# EAGLE design BSAT - Battery Shield (EAGLE 6.5.0)
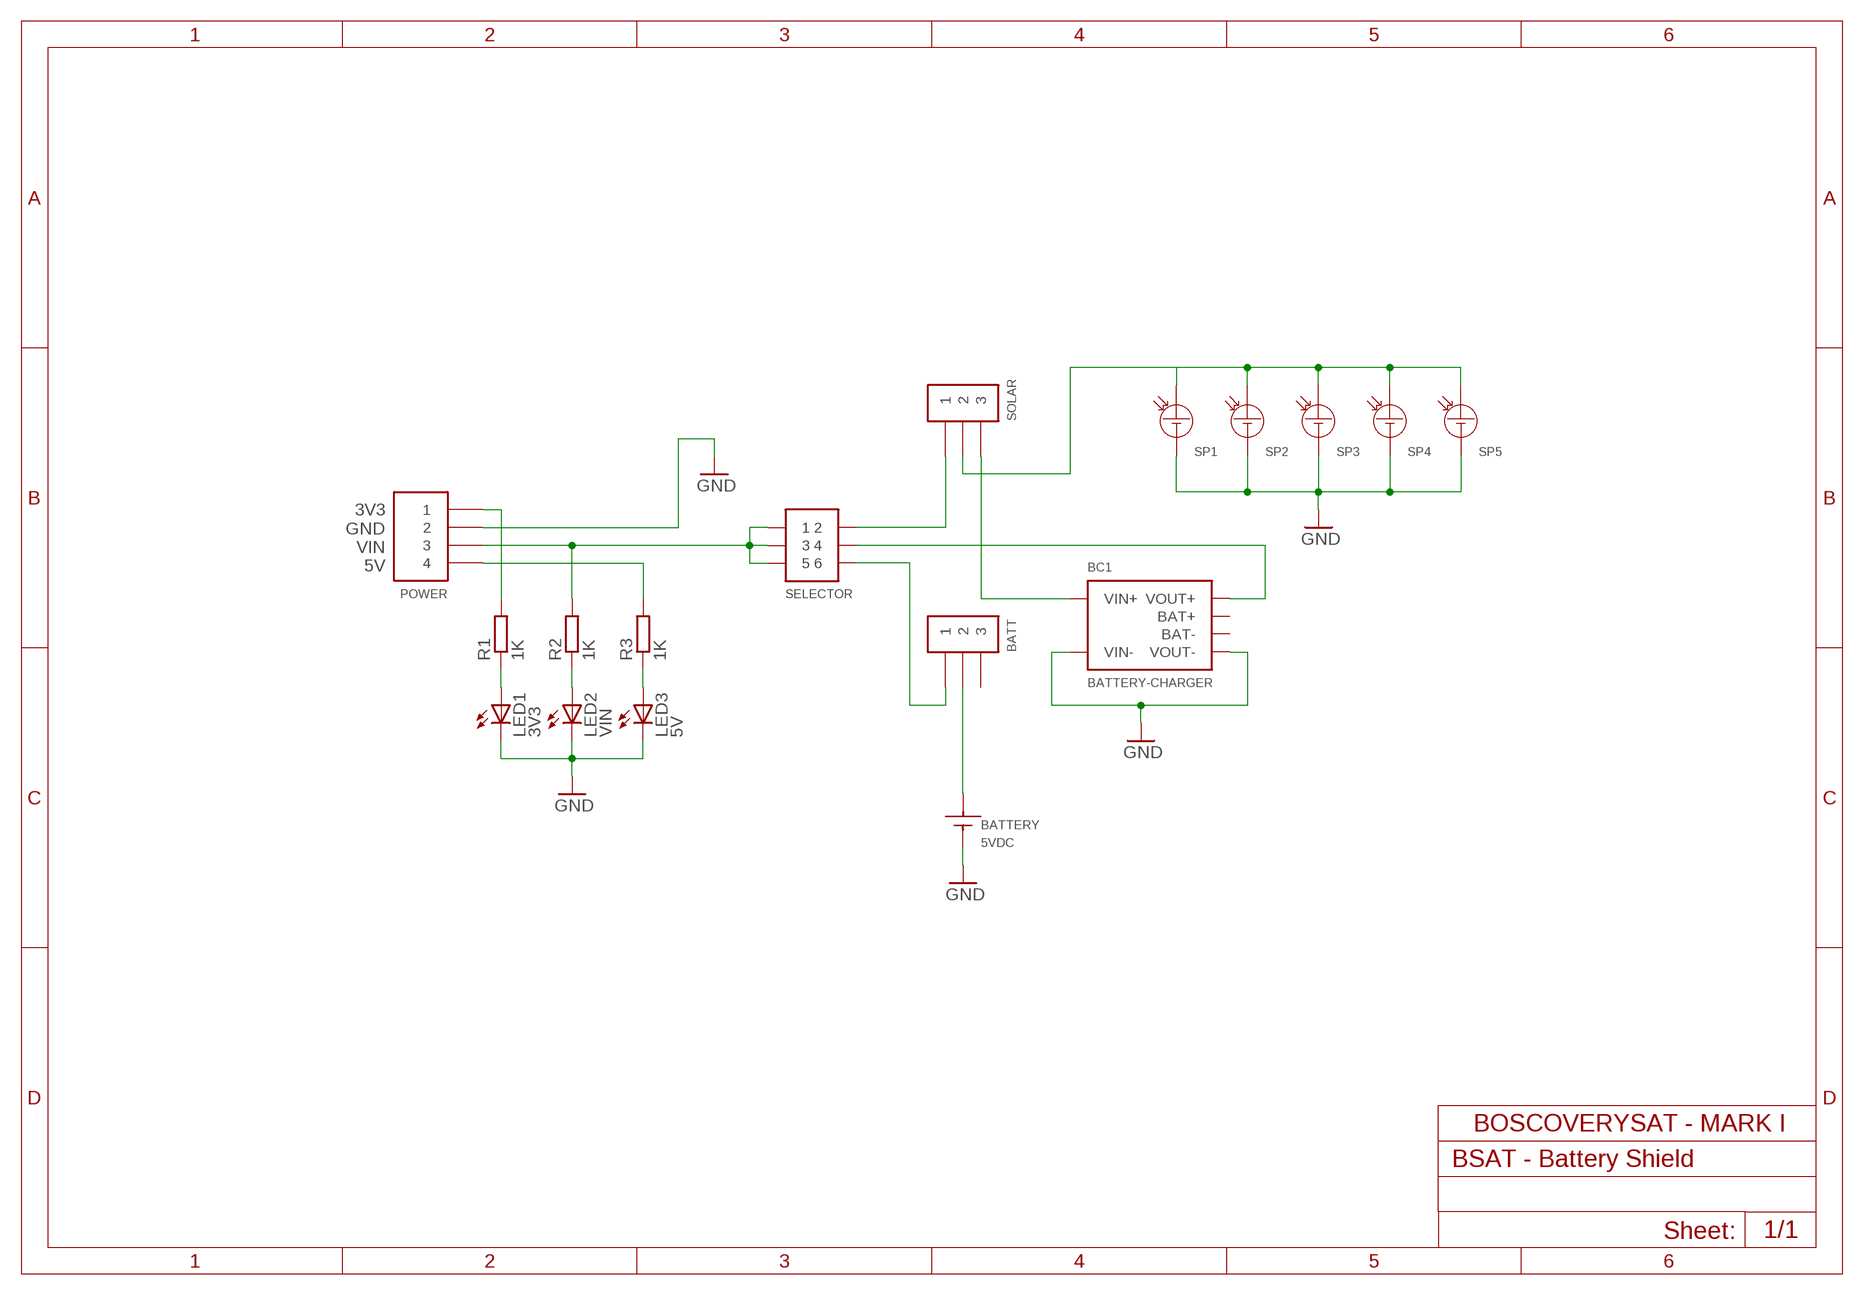
[diagram p0: schematic, sheet 1]

## Parts
5VDC  BATTERY  [SOLAR-PANEL]
BATT  3-PIN-JUMPER  [3-PIN-JUMPER]
BC1  BATTERY-CHARGER  [BATTERY-CHARGER]
LED1  3V3  LED3MM  [LED3MM]
LED2  VIN  LED3MM  [LED3MM]
LED3  5V  LED3MM  [LED3MM]
POWER  4-PIN-DUAL-BUS  [4-PIN-LINEAL-JUMPER]
R1  1K  R-EU_0207/12  [0207/12]
R2  1K  R-EU_0207/12  [0207/12]
R3  1K  R-EU_0207/12  [0207/12]
SELECTOR  3-PIN-PARALEL-JUMPER  [3-PIN-PARALEL-JUMPER]
SOLAR  3-PIN-JUMPER  [3-PIN-JUMPER]
SP1  SOLAR-PANEL2  [SOLAR-PANEL]
SP2  SOLAR-PANEL2  [SOLAR-PANEL]
SP3  SOLAR-PANEL2  [SOLAR-PANEL]
SP4  SOLAR-PANEL2  [SOLAR-PANEL]
SP5  SOLAR-PANEL2  [SOLAR-PANEL]

## Nets
GND: 5VDC.NEG BC1.VIN- BC1.VOUT- LED1.K(C) LED2.K(C) LED3.K(C) POWER.2A POWER.2B SP1.NEG SP2.NEG SP3.NEG SP4.NEG SP5.NEG
N$1: SELECTOR.2 SOLAR.1
N$2: SOLAR.2 SP1.POS SP2.POS SP3.POS SP4.POS SP5.POS
N$3: BC1.VIN+ SOLAR.3
N$4: BC1.VOUT+ SELECTOR.4
N$5: BATT.1 SELECTOR.6
N$6: 5VDC.POS BATT.2
N$8: LED1.A R1.1
N$9: POWER.3A POWER.3B R2.2 SELECTOR.1 SELECTOR.3 SELECTOR.5
N$10: LED2.A R2.1
N$11: LED3.A R3.1
N$12: POWER.1A POWER.1B R1.2
N$13: POWER.4A POWER.4B R3.2
Unconnected: BATT.3 BC1.BAT+ BC1.BAT-

## Notes on the sheet
- 3V3
  GND
  VIN
  5V

## Library data of the parts
5VDC = boscoverysat:BATTERY
BATT SOLAR = boscoverysat:3-PIN-JUMPER
BC1 = boscoverysat:BATTERY-CHARGER
LED1-LED3 = boscoverysat:LED: LED OSRAM: - CHIPLED LG R971, LG N971, LY N971, LG Q971, LY Q971, LO R971, LY R971 LH N974, LH R974 LS Q976, LO Q976, LY Q976 LO Q996 - Hyper CHIPLED LW Q18S LB Q993, LB Q99A, LB R99A - SideLED LS A670, LO A670, LY A670, LG A670, LP A670 LB A673, LV A673, LT A673, LW A673 LH A674 LY A675 LS A676, LA A676, LO A676, LY A676, LW A676 LS A679, LY A679, LG A679 - Hyper Micro SIDELED® LS Y876, LA Y876, LO Y876, LY Y876 LT Y87S - SmartLED LW L88C, LW L88S LB L89C, LB L89S, LG L890 LS L89K, LO L89K, LY L89K LS L896, LA L896, LO L896, LY L896 - TOPLED LS T670, LO T670, LY T670, LG T670, LP T670 LSG T670, LSP T670, LSY T670, LOP T670, LYG T670 LG T671, LOG T671, LSG T671 LB T673, LV T673, LT T673, LW T673 LH T674 LS T676, LA T676, LO T676, LY T676, LB T676, LH T676, LSB T676, LW T676 LB T67C, LV T67C, LT T67C, LS T67K, LO T67K, LY T67K, LW E67C LS E67B, LA E67B, LO E67B, LY E67B, LB E67C, LV E67C, LT E67C LW T67C LS T679, LY T679, LG T679 LS T770, LO T770, LY T770, LG T770, LP T770 LB T773, LV T773, LT T773, LW T773 LH T774 LS E675, LA E675, LY E675, LS T675 LS T776, LA T776, LO T776, LY T776, LB T776 LHGB T686 LT T68C, LB T68C - Hyper Mini TOPLED® LB M676 - Mini TOPLED Santana® LG M470 LS M47K, LO M47K, LY M47K Source: http://www.osram.convergy.de/
POWER = boscoverysat:4-PIN-DUAL-BUS
R1-R3 = boscoverysat:R-EU_: RESISTOR, European symbol
SELECTOR = boscoverysat:3-PIN-PARALEL-JUMPER
SP1-SP5 = boscoverysat:SOLAR-PANEL

## Board
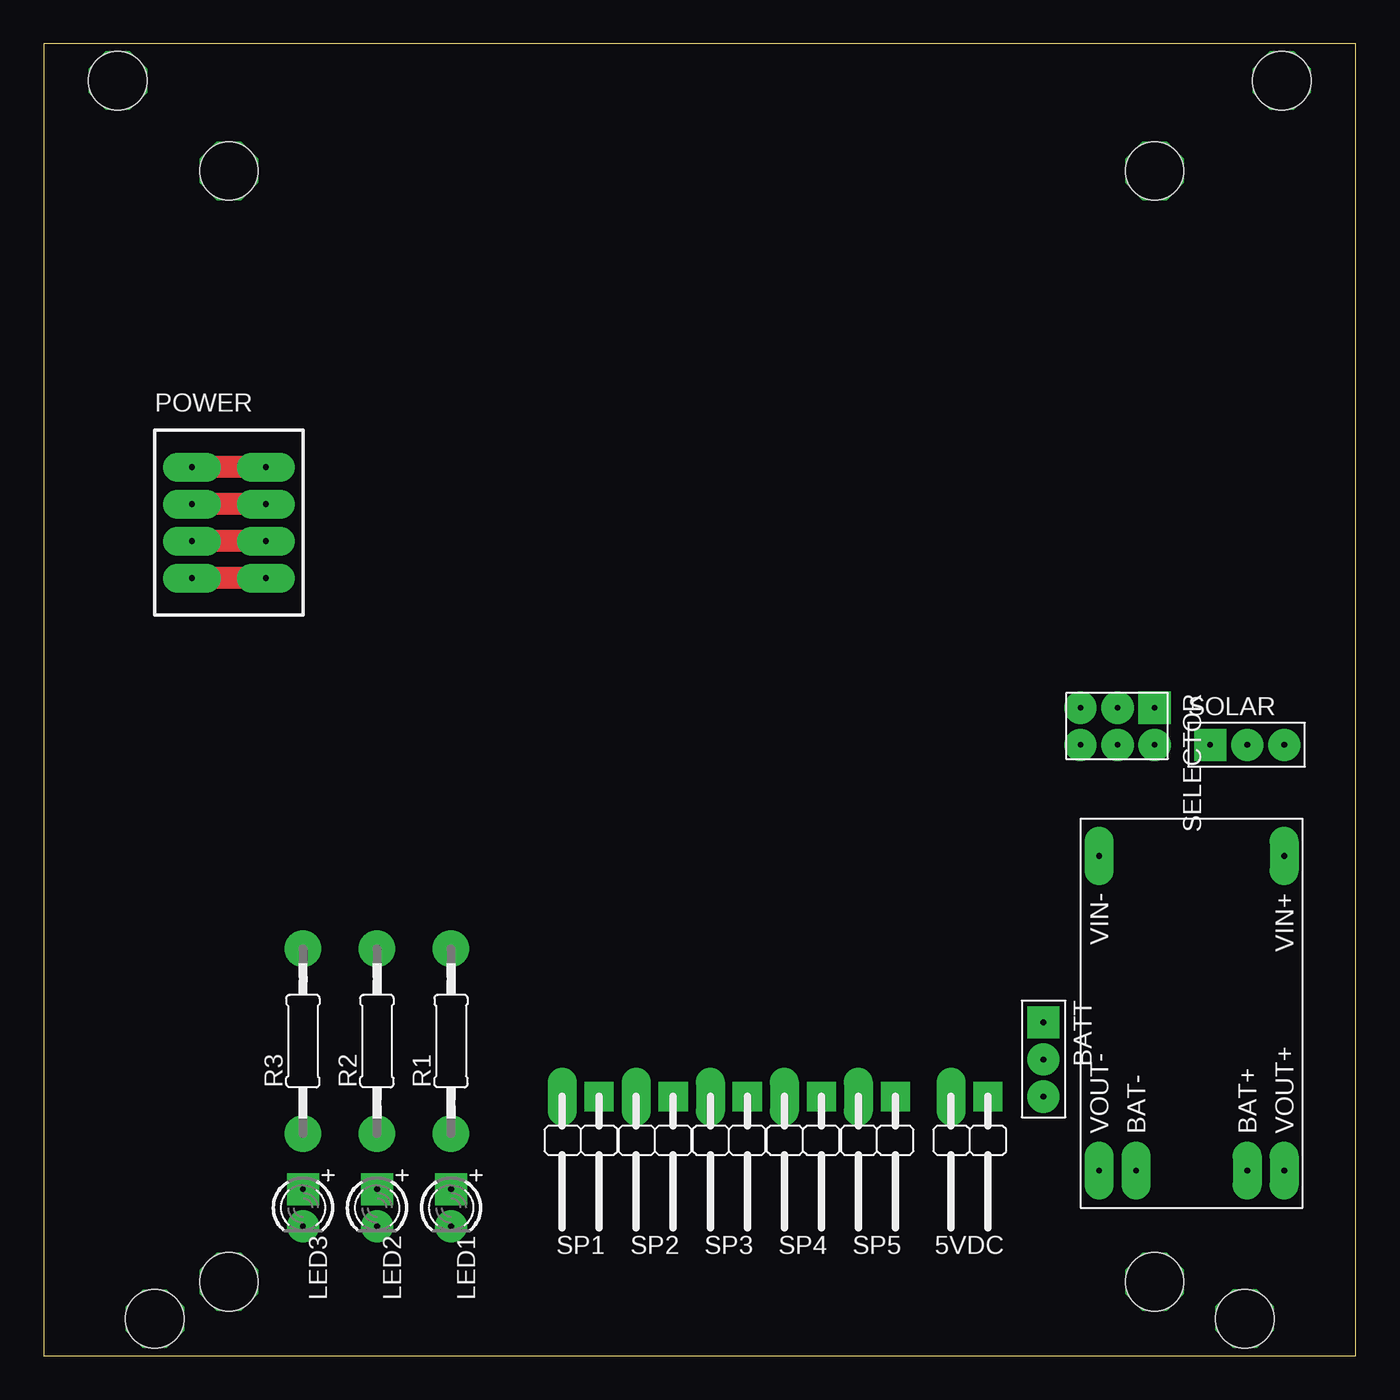
[diagram p1: board, top side]
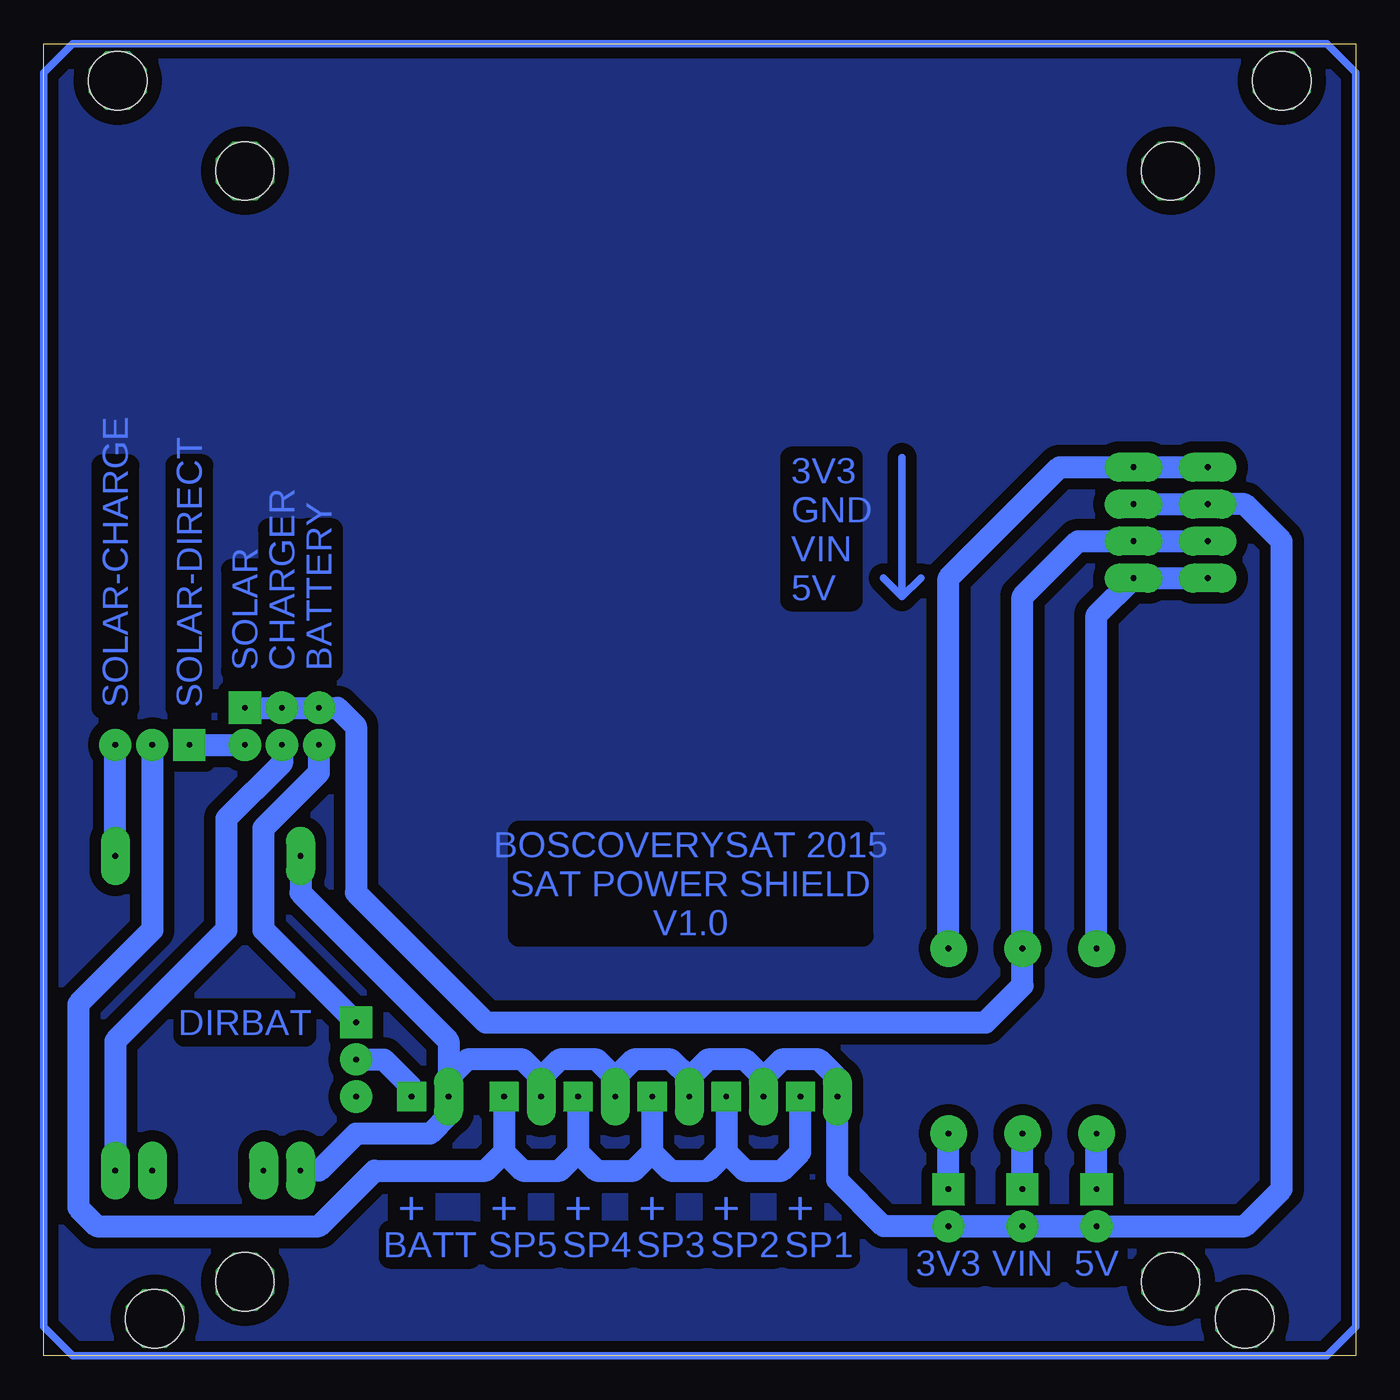
[diagram p2: board, bottom side, seen from below]

Size 90 x 90 mm. Coordinates in mm from the lower left corner, seen from the top.
Outline: 0,0 90,0 90,90 0,90 0,0
Copper layers (1*16): Top 0.035mm / dielectric 1.5mm / Bottom 0.035mm
Design rules "default *": minimum track width 10mil, minimum drill 24mil, track to track 30mil, track to pad 30mil, pad to pad 30mil, via to via 30mil, smd to smd 8mil, copper to edge 40mil, drill to drill 8mil, minimum pad ring 10mil, minimum via ring 8mil, stop-mask expansion 4mil, vias tented up to drill 0mil, thermal gap 10mil
Holes 4 mm at 7.62,2.54 82.38,2.54 5.08,87.47 84.92,87.47 12.7,5.08 76.2,5.08 12.7,81.28 76.2,81.28

### Footprints (pad centres in the part's own frame; a part is rotated, then mirrored left to right if it is on the bottom)
SOLAR-PANEL = drill 0.4 pad 2 long: NEG 2.54,0 | drill 0.4 pad 2 square: POS 0,0
3-PIN-JUMPER = drill 0.4 pad 2.2 square: 1 0,0 | drill 0.4 pad 2.2: 2 2.54,0; 3 5.08,0
BATTERY-CHARGER = drill 0.4 pad 2 long: BAT+ 21.59,10.16; BAT- 21.59,2.54; VIN+ 0,12.7; VIN- 0,0; VOUT+ 21.59,12.7; VOUT- 21.59,0
LED3MM = drill 0.4 pad 2.2 square: A -1.27,0 | drill 0.4 pad 2.2: K 1.27,0
4-PIN-LINEAL-JUMPER = drill 0.4 pad 2 long: 1A 0,7.62; 1B 5.08,7.62; 2A 0,5.08; 2B 5.08,5.08; 3A 0,2.54; 3B 5.08,2.54; 4A 0,0; 4B 5.08,0
0207/12 = drill 0.4 pad 2.5: 1 -6.35,0; 2 6.35,0
3-PIN-PARALEL-JUMPER = drill 0.4 pad 2.2 square: 1 0,5.08 | drill 0.4 pad 2.2: 2 2.54,5.08; 3 0,2.54; 4 2.54,2.54; 5 0,0; 6 2.54,0

### Placement (x,y rotation side)
5VDC  64.77,17.78 180 top
BATT  68.58,22.86 270 top
BC1  72.39,34.29 270 top
LED1  27.94,10.16 270 top
LED2  22.86,10.16 270 top
LED3  17.78,10.16 270 top
POWER  10.16,53.34 0 top
R1  27.94,21.59 90 top
R2  22.86,21.59 90 top
R3  17.78,21.59 90 top
SELECTOR  71.12,44.45 270 top
SOLAR  80.01,41.91 0 top
SP1  38.1,17.78 180 top
SP2  43.18,17.78 180 top
SP3  48.26,17.78 180 top
SP4  53.34,17.78 180 top
SP5  58.42,17.78 180 top

### Tracks (layer width: path | path; a pad name or v marks a point on that pad's centre or on a via)
GND
  Bottom 1.524: POWER.2A 7.62,58.42 5.08,55.88 5.08,11.43 7.62,8.89 LED1.K LED2.K LED3.K 32.38,8.89 35.56,12.06 SP1.NEG 35.56,19.05 36.83,20.32 39.37,20.32 40.64,19.05 | 40.64,19.05 SP2.NEG | 40.64,19.05 41.91,20.32 44.45,20.32 45.72,19.05 | 45.72,19.05 SP3.NEG | 45.72,19.05 46.99,20.32 49.53,20.32 50.8,19.05 | SP4.NEG 50.8,19.05 | 50.8,19.05 52.07,20.32 54.61,20.32 55.88,19.05 | SP5.NEG 55.88,19.05 | 55.88,19.05 57.15,20.32 60.96,20.32 62.23,19.05 5VDC.NEG | 5VDC.NEG 62.23,16.51 63.5,15.24 68.58,15.24 71.12,12.7 BC1.VOUT- | BC1.VIN- 72.39,31.75 62.23,21.59 5VDC.NEG
N$1
  Bottom 1.524: SOLAR.1 SELECTOR.2
N$2
  Bottom 1.524: SOLAR.2 82.55,29.21 87.63,24.13 87.63,10.16 86.36,8.89 71.12,8.89 67.31,12.7 59.69,12.7 58.42,13.97 | SP5.POS 58.42,13.97 | 58.42,13.97 57.15,12.7 54.61,12.7 53.34,13.97 | SP4.POS 53.34,13.97 | 53.34,13.97 52.07,12.7 49.53,12.7 48.26,13.97 | SP3.POS 48.26,13.97 | 48.26,13.97 46.99,12.7 44.45,12.7 43.18,13.97 | SP2.POS 43.18,13.97 | 43.18,13.97 41.91,12.7 39.37,12.7 38.1,13.97 SP1.POS
N$3
  Bottom 1.524: BC1.VIN+ SOLAR.3
N$4
  Bottom 1.524: SELECTOR.4 73.66,40.64 77.47,36.83 77.47,29.21 85.09,21.59 BC1.VOUT+
N$5
  Bottom 1.524: BATT.1 74.93,29.21 74.93,36.2 71.12,40.01 SELECTOR.6
N$6
  Bottom 1.524: BATT.2 66.67,20.32 64.77,18.41 5VDC.POS
N$8
  Bottom 1.524: LED1.A R1.1
N$9
  Bottom 1.524: SELECTOR.1 SELECTOR.3 SELECTOR.5 69.85,44.45 68.58,43.18 68.58,31.75 59.69,22.86 25.4,22.86 22.86,25.4 R2.2 22.86,52.07 19.05,55.88 POWER.3B
N$10
  Bottom 1.524: LED2.A R2.1
N$11
  Bottom 1.524: LED3.A R3.1
N$12
  Bottom 1.524: R1.2 27.94,53.34 20.32,60.96 POWER.1B
N$13
  Bottom 1.524: R3.2 17.78,50.8 POWER.4B
N$14  (via drill 0.4 pad 4)
  other vias: 82.38,2.56
N$15  (via drill 0.4 pad 4)
  other vias: 7.62,2.54
N$16  (via drill 0.4 pad 4)
  other vias: 5.08,87.47
N$17  (via drill 0.4 pad 4)
  other vias: 84.92,87.47
N$18  (via drill 0.4 pad 4)
  other vias: 12.7,5.08
N$19  (via drill 0.4 pad 4)
  other vias: 76.2,5.08
N$20  (via drill 0.4 pad 4)
  other vias: 12.7,81.28
N$21  (via drill 0.4 pad 4)
  other vias: 76.2,81.28
N$22
  Bottom 0.508: 31.11,61.59 31.11,52.07 | 31.11,52.07 32.38,53.34 | 31.11,52.07 29.84,53.34
N$23
  Bottom 0.5: 2,90 0,88 0,2 2,0 88,0 90,2 90,88 88,90 2,90
N$24
  pour Bottom: 2,90 0,88 0,2 2,0 88,0 90,2 90,88 88,90

### Text on the board
Bottom: 3V3 / GND / VIN / 5V | BATTERY | CHARGER | SOLAR | SOLAR-DIRECT | SOLAR-CHARGE | BOSCOVERYSAT 2015 / SAT POWER SHIELD / V1.0 | DIRBAT | + | + | + | + | + | + | SP1 | SP2 | SP3 | SP4 | SP5 | BATT | 5V | VIN | 3V3